# EAGLE board AT SoM Carrier Board V1.1 (EAGLE 9.6.1), part 1 of 2
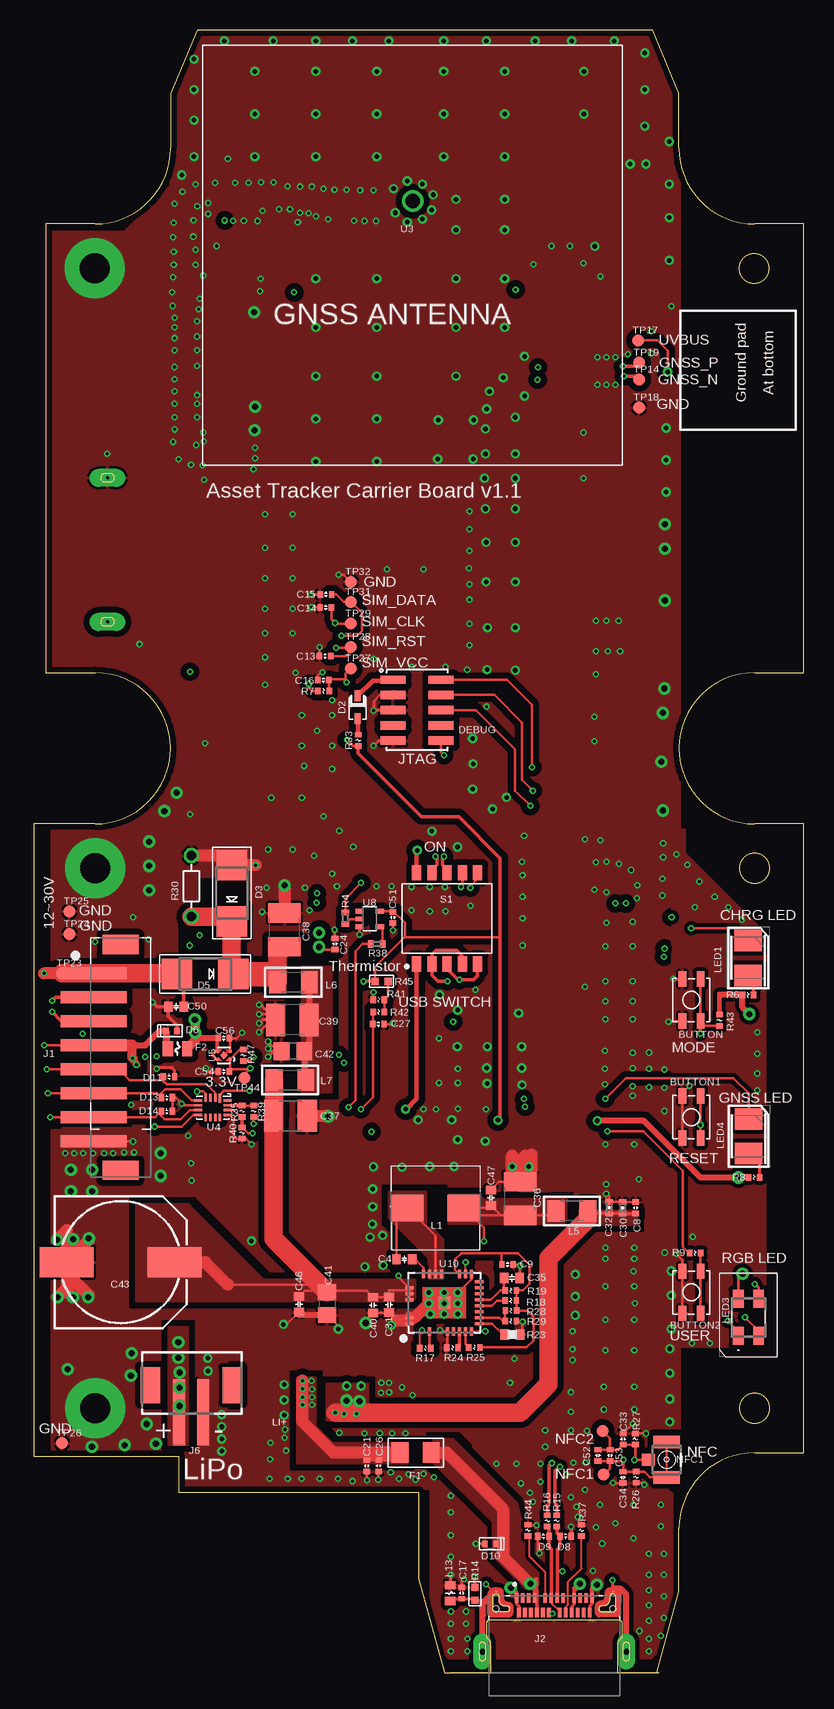
[diagram p4: board, top side]
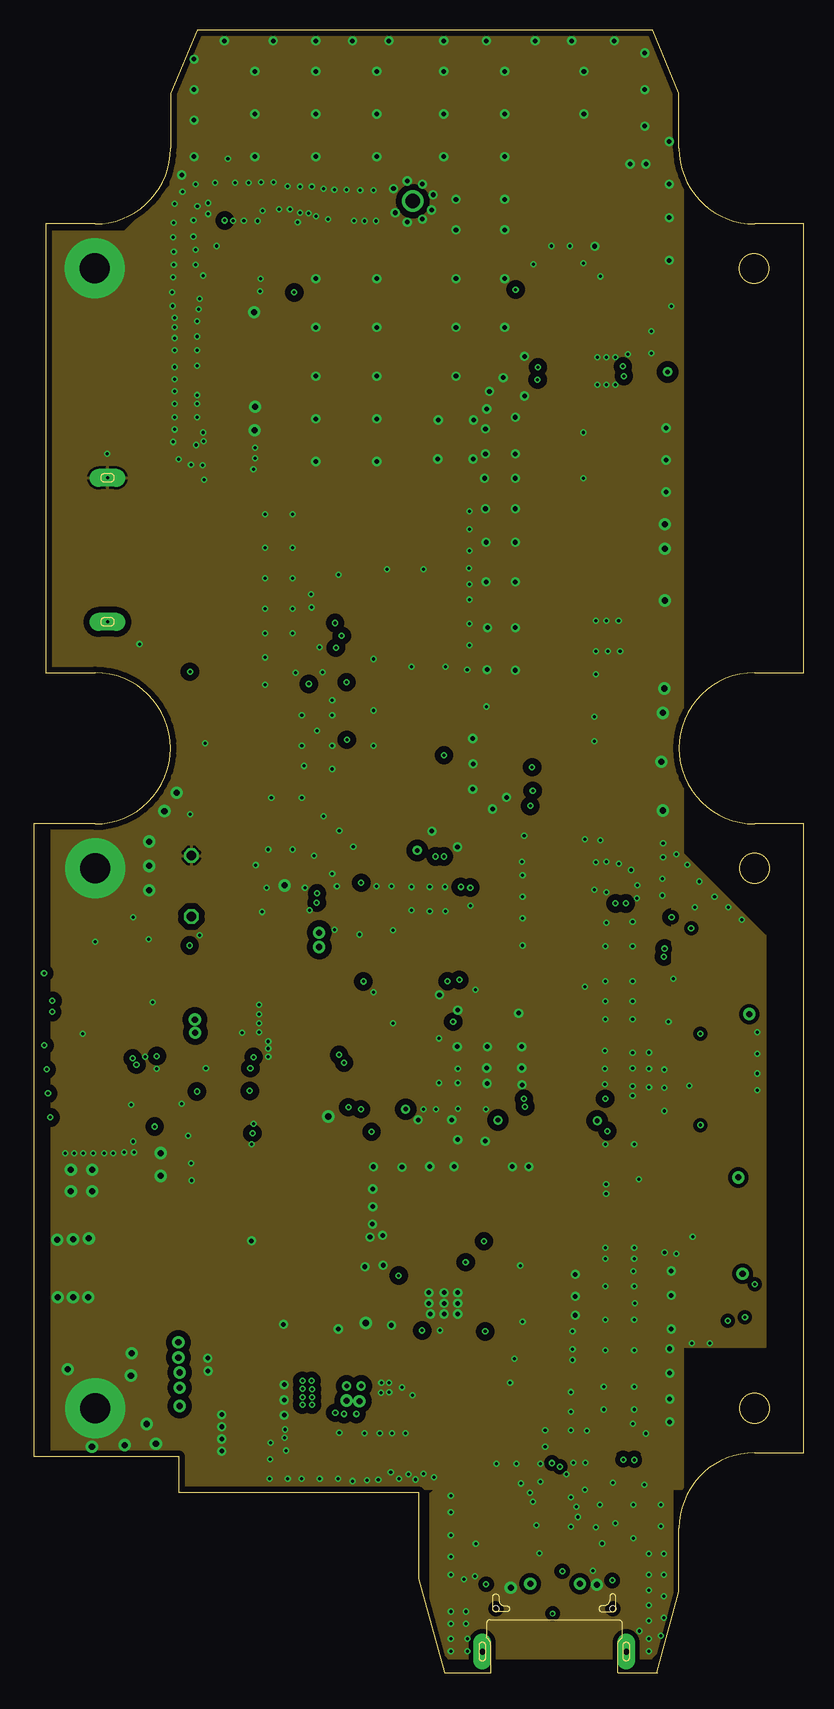
[diagram p5: board, inner layer L2-SIGNAL]
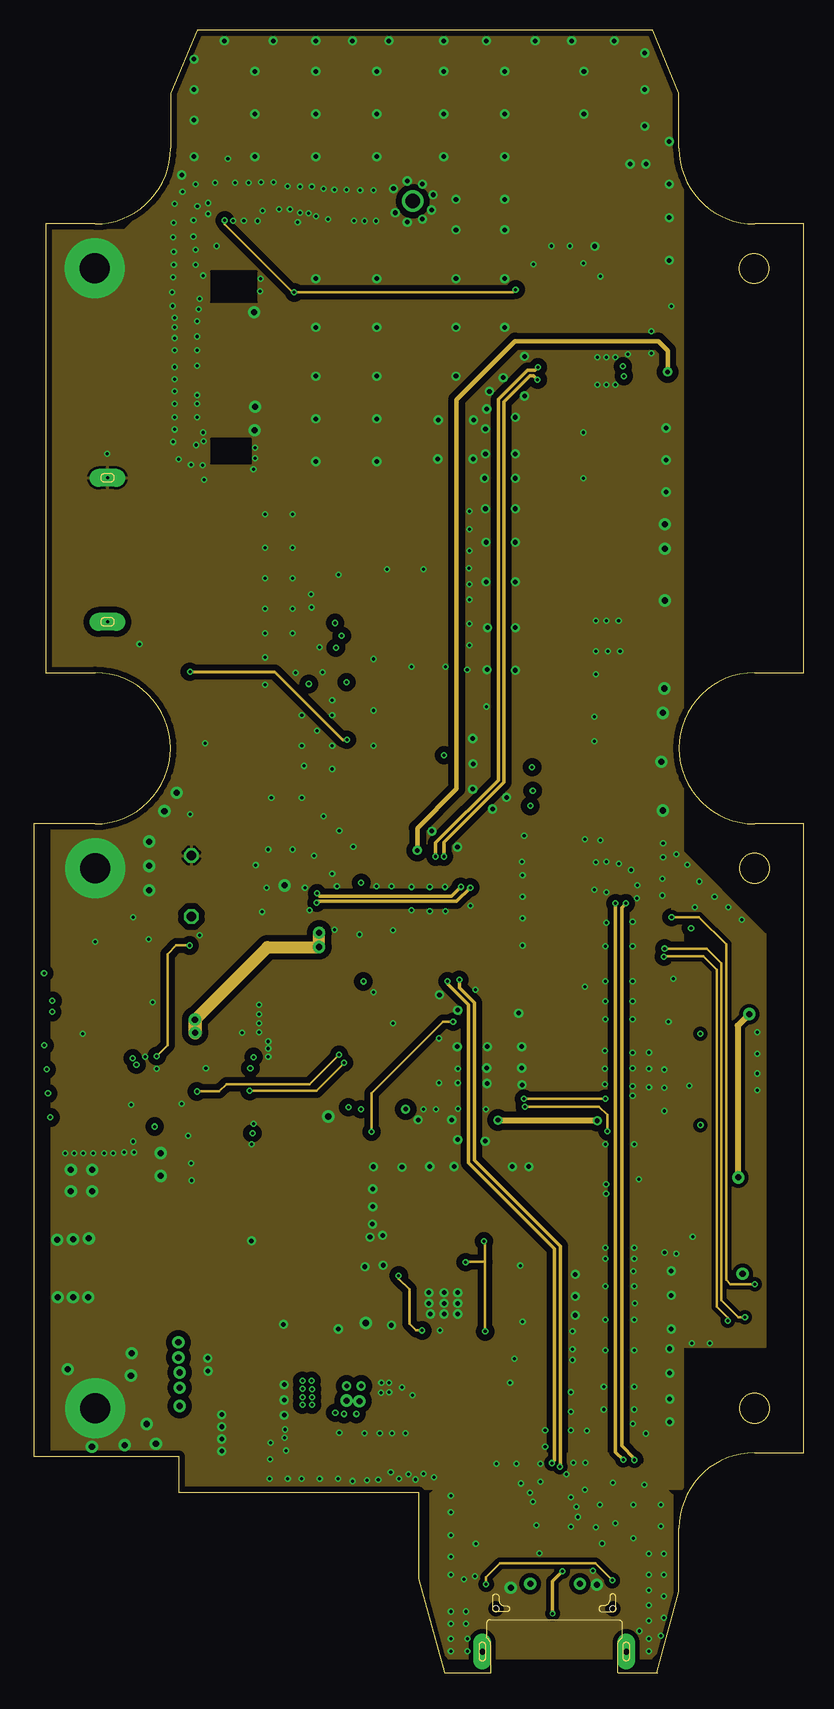
[diagram p6: board, inner layer L5-SIGNAL]
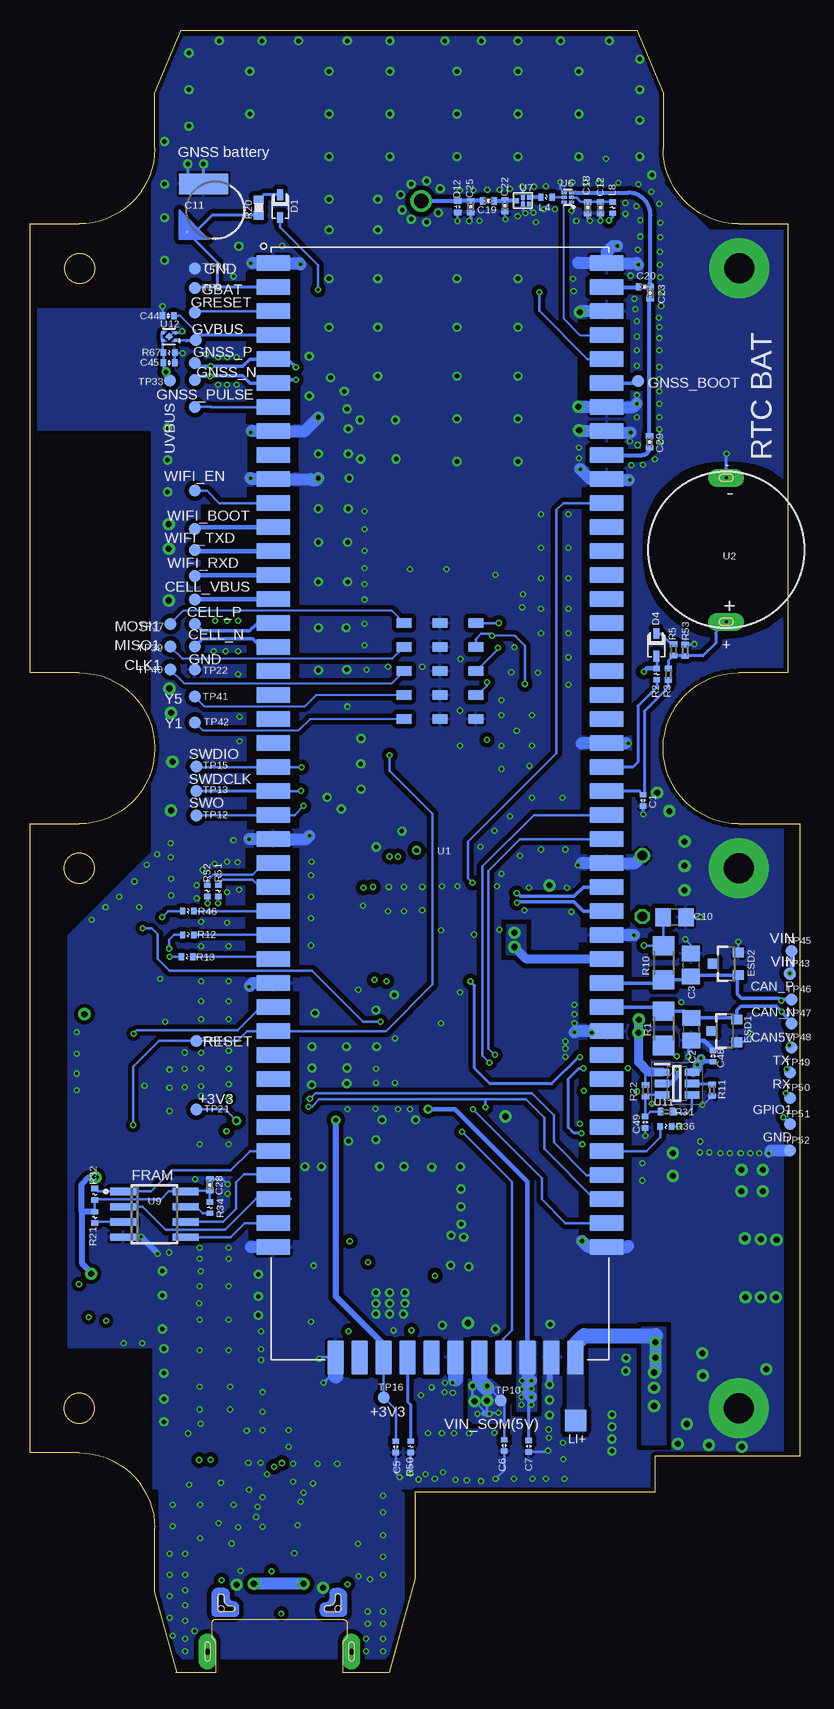
[diagram p7: board, bottom side, seen from below]

Size 64.2 x 136.88 mm. Coordinates in mm from the lower left corner, seen from the top.
Outline: 53.8,6.72 53.8,12.02 arc-90 60.1,18.32 64.2,18.32 64.2,70.72 60.1,70.72 arc-180 60.1,83.32 64.2,83.32 64.2,120.72 60.1,120.72 arc-90 53.8,127.02 53.8,131.6 51.6,136.88 13.6,136.88 11.4,131.6 11.4,127.02 arc-90 5.1,120.72 1,120.72 1,83.32 5.1,83.32 arc-180 5.1,70.72 0,70.72 0,18.02 12.09,18.02 12.09,15.02 32.09,15.02 32.09,7.81 34.26,0 38.1,0 38.09,0
Outline: 48.69,0 51.93,0 53.79,6.73
Outline: circle at 60.09,22.02 radius 1.25
Outline: circle at 60.1,22.02 radius 1.25
Outline: circle at 60.1,22.02 radius 1.25
Outline: circle at 60.09,67.02 radius 1.25
Outline: circle at 60.05,117 radius 1.25
Copper layers (1+2*15+16): L1-TOP 0.035mm / dielectric 0.1mm / L2-SIGNAL 0.0175mm / dielectric 0.365mm / L5-SIGNAL 0.035mm / dielectric 0.1mm / L6-BOTTOM 0.035mm
Design rules "particle-6layer *": minimum track width 4mil, minimum drill 0.1mm, track to track 6mil, track to pad 6mil, pad to pad 6mil, via to via 6mil, smd to smd 0mil, copper to edge 6mil, drill to drill 6mil, minimum pad ring 4mil, minimum via ring 4mil, stop-mask expansion 0mil, vias tented up to drill 20mil, thermal gap 8mil
Net classes: 2 RF: width 0.293 mm, clearance 0.257 mm; 3 usb_lay3: width 0.279 mm, clearance 0.203 mm; 4 3V3: width 0.305 mm, clearance 0.508 mm; 5 USB_top: width 0.279 mm, drill 0.254 mm, clearance 0.203 mm; 6 +3V3: width 0.203 mm, clearance 0.152 mm; 7 PMID: width 0.305 mm, clearance 0.508 mm; 8 CAN: width 0.152 mm, clearance 0.267 mm

## Footprints (pad centres in the part's own frame; a part is rotated, then mirrored left to right if it is on the bottom)
TS-1185A-020 = smd 1.27 x 0.635: 1 -1.75,0.752; 2 1.75,0.752; 3 -1.75,-0.752; 4 1.75,-0.752
C-0402 = smd 0.45 x 0.55: 1 -0.47,0; 2 0.47,0
C0805 = smd 1.3 x 1.5: 1 -0.95,0; 2 0.95,0
C-0603A = smd 0.7 x 0.85: 1 -0.65,0; 2 0.65,0
ML414H = smd 0.2 x 0.2: + 2.4,1.8 | smd 4.1 x 1.7: - 1,-2.2
C0402_P = smd 0.457 x 0.61: 1 -0.483,0; 2 0.483,0
PARTICLE-SZ_C-0402 = smd 0.45 x 0.55: 1 -0.47,0; 2 0.47,0
C1210 = smd 1.6 x 2.7: 1 -1.4,0; 2 1.4,0
NIC_10X10.5_CAP = smd 4.5 x 2.5: + 4.5,0; - -4.5,0
SOD-323 = smd 0.9 x 0.5: 1 -0.95,0; 2 0.95,0
SMADIODE = smd 2.54 x 2.54: A 2.349,0; C -2.349,0
0402-TVS-UNIDIR = smd 0.45 x 0.55: 1 -0.47,0; 2 0.47,0
C0402 = smd 0.45 x 0.6: 1 -0.47,0; 2 0.47,0
CON5X2_1.27 = smd 0.7 x 2.1: 1 -2.54,-2; 2 -2.54,2; 3 -1.27,-2; 4 -1.27,2; 5 0,-2; 6 0,2; 7 1.27,-2; 8 1.27,2; 9 2.54,-2; 10 2.54,2
SOT23-3 = smd 0.8 x 0.9: 1 -0.95,-1; 2 0.95,-1; 3 0,1.1
R1206 = smd 1.4 x 1.7: 1 -1.3,0; 2 1.3,0
F0805 = smd 0.85 x 1.25: P$1 -0.8,0; P$2 0.8,0
JST_B8B-PH-SM4-TB(LF)(SN) = smd 1 x 5.5: 1 -5,0; 2 -3,0; 3 -1,0; 4 1,0; 5 3,0; 6 5,0; 7 7,0; 8 9,0 | smd 1.6 x 3: P1 -7.4,2.25; P2 11.4,2.25
AMPHENOL_124018312112A = smd 0.3 x 0.8: A1 -3.15,4.45; A2 -2.65,4.45; A3 -2.15,4.45; A4 -1.65,4.45; A5 -0.75,4.45; A6 -0.25,4.45; A7 0.25,4.45; A8 0.75,4.45; A9 1.65,4.45; A10 2.15,4.45; A11 2.65,4.45; A12 3.15,4.45; B1 2.95,3.25; B2 2.45,3.25; B3 1.95,3.25; B4 1.45,3.25; B5 0.95,3.25; B6 0.45,3.25; B7 -0.45,3.25; B8 -0.95,3.25; B9 -1.45,3.25; B10 -1.95,3.25; B11 -2.45,3.25; B12 -2.95,3.25 | drill 0.5 pad 1.5 long: S1 -6,0; S2 6,0 | smd 0.1 x 0.1: S3 -4.849,5.002; S4 4.901,4.976 | hole 0.5: -4.875,3.56; 4.875,3.56
JST-2-SMD-VERT = smd 1 x 5.5: GND 1,-2; VCC -1,-2 | smd 1.6 x 3: P$1 -3.4,0.27; P$2 3.4,0.27
ETQP4M150KFN = smd 2.7 x 2.2: 1 -2.35,0; 2 2.35,0
R-0402S = smd 0.45 x 0.55: 1 -0.47,0; 2 0.47,0
L1206 = smd 1.4 x 1.8: 1 -1.329,0; 2 1.329,0
R-0603A = smd 0.7 x 0.85: 1 -0.65,0; 2 0.65,0
LEDM3528X210N = smd 1.8 x 2.3: 1 -1.45,0; 2 1.45,0
150141M173100 = smd 1.5 x 0.9: 1 1.55,0.85; 2 1.55,-0.85; 3 -1.55,0.85; 4 -1.55,-0.85
IPEX-20279-001E = smd 1 x 1.05: 1 0,1.528 | smd 1.05 x 2.2: 2@1 -1.475,0; 2@2 1.475,0
R1206' = smd 1.6 x 1.803: 1 -1.422,0; 2 1.422,0
R0402_B = smd 0.457 x 0.61: 1 -0.483,0; 2 0.483,0
REDBEAR_R0603 = smd 0.6 x 0.6: 1 -0.55,0; 2 0.55,0
R0603_P = smd 0.7 x 0.85: 1 -0.65,0; 2 0.65,0
R-5 = drill 0.813 octagon: 1 -2.54,0; 2 2.54,0
R0603 = smd 0.6 x 0.6: 1 -0.55,0; 2 0.55,0
416131160805 = smd 0.76 x 1.27: 1 -2.54,-3.81; 2 -1.27,-3.81; 3 0,-3.81; 4 1.27,-3.81; 5 2.54,-3.81; A1 -2.54,3.81; A2 -1.27,3.81; A3 0,3.81; A4 1.27,3.81; A5 2.54,3.81
TP10R = smd 1 x 1: TP 0,0
TRACKERSOM_V04 = smd 2.8 x 1.35: 1 27.9,-91.3; 2 27.9,-89.3; 3 27.9,-87.3; 4 27.9,-85.3; 5 27.9,-83.3; 6 27.9,-81.3; 7 27.9,-79.3; 8 27.9,-77.3; 9 27.9,-75.3; 10 27.9,-73.3; 11 27.9,-71.3; 12 27.9,-69.3; 13 27.9,-67.3; 14 27.9,-65.3; 15 27.9,-63.3; 16 27.9,-61.3; 17 27.9,-59.3; 18 27.9,-57.3; 19 27.9,-55.3; 20 27.9,-53.3; 21 27.9,-51.3; 22 27.9,-49.3; 23 27.9,-47.3; 24 27.9,-45.3; 25 27.9,-43.3; 26 27.9,-41.3; 27 27.9,-39.3; 28 27.9,-37.3; 29 27.9,-35.3; 30 27.9,-33.3; 31 27.9,-31.3; 32 27.9,-29.3; 33 27.9,-27.3; 34 27.9,-25.3; 35 27.9,-23.3; 36 27.9,-21.3; 37 27.9,-19.3; 38 27.9,-17.3; 39 27.9,-15.3; 40 27.9,-13.3; 41 27.9,-11.3; 42 27.9,-9.3; 54 0.1,-9.3; 55 0.1,-11.3; 56 0.1,-13.3; 57 0.1,-15.3; 58 0.1,-17.3; 59 0.1,-19.3; 60 0.1,-21.3; 61 0.1,-23.3; 62 0.1,-25.3; 63 0.1,-27.3; 64 0.1,-29.3; 65 0.1,-31.3; 66 0.1,-33.3; 67 0.1,-35.3; 68 0.1,-37.3; 69 0.1,-39.3; 70 0.1,-41.3; 71 0.1,-43.3; 72 0.1,-45.3; 73 0.1,-47.3; 74 0.1,-49.3; 75 0.1,-51.3; 76 0.1,-53.3; 77 0.1,-55.3; 78 0.1,-57.3; 79 0.1,-59.3; 80 0.1,-61.3; 81 0.1,-63.3; 82 0.1,-65.3; 83 0.1,-67.3; 84 0.1,-69.3; 85 0.1,-71.3; 86 0.1,-73.3; 87 0.1,-75.3; 88 0.1,-77.3; 89 0.1,-79.3; 90 0.1,-81.3; 91 0.1,-83.3; 92 0.1,-85.3; 93 0.1,-87.3; 94 0.1,-89.3; 95 0.1,-91.3 | smd 1.35 x 2.8: 43 22.7,-0.1; 44 20.7,-0.1; 45 18.7,-0.1; 46 16.7,-0.1; 47 14.7,-0.1; 48 12.7,-0.1; 49 10.7,-0.1; 50 8.7,-0.1; 51 6.7,-0.1; 52 4.7,-0.1; 53 2.7,-0.1 | smd 1.3 x 0.83: 96 17,-61.3; 97 17,-59.3; 98 17,-57.3; 99 17,-55.3; 100 17,-53.3; 101 11,-55.3; 102 11,-57.3; 103 11,-59.3; 104 11,-61.3; 105 11,-53.3; 106 14,-53.3; 107 14,-55.3; 108 14,-57.3; 109 14,-59.3; 110 14,-61.3
BAT_ML-1220/DIP = drill 0.254 pad 1.5 long: 1 0,12; 2 0,0
PA035AZ0004 = drill 1.2 pad 1.8: P$1 0,-4.5
UQFN-16 = smd 0.2 x 0.75: 1 -0.6,-0.775 | smd 0.2 x 0.65: 2 -0.2,-0.825; 3 0.2,-0.825; 4 0.6,-0.825; 9 0.6,0.825; 10 0.2,0.825; 11 -0.2,0.825; 12 -0.6,0.825 | smd 0.65 x 0.2: 5 1.225,-0.6; 6 1.225,-0.2; 7 1.225,0.2; 8 1.225,0.6; 13 -1.225,0.6; 14 -1.225,0.2; 15 -1.225,-0.2; 16 -1.225,-0.6
USPQ-4B04 = smd 0.25 x 0.22: P$1 -0.325,-0.54; P$2 0.325,-0.54; P$3 0.325,0.54; P$4 -0.325,0.54 | smd 0.45 x 0.45 rotated 45: P$5 0,0
LNA-TSLP-6-2-ALT = smd 0.45 x 0.25: 1 -0.3,0.4; 2 -0.3,0; 3 -0.3,-0.4; 4 0.3,-0.4; 5 0.3,0; 6 0.3,0.4
QCS5I = smd 0.35 x 0.425: 1 -0.5,0; 2 0,-0.287; 3 0.5,-0.287; 4 0.5,0.287; 5 0,0.287
SC70-5 = smd 0.4 x 0.7: 1 -0.65,-0.85; 2 0,-0.85; 3 0.65,-0.85; 4 0.65,0.85; 5 -0.65,0.85
SO08 = smd 0.6 x 2.2: 1 -1.905,-2.6; 2 -0.635,-2.6; 3 0.635,-2.6; 4 1.905,-2.6; 5 1.905,2.6; 6 0.635,2.6; 7 -0.635,2.6; 8 -1.905,2.6
UHE36(26)QFN = smd 0.25 x 0.7: 3 -1.25,-2.4; 6 0.25,-2.4; 7 0.75,-2.4; 8 1.25,-2.4; 9 1.75,-2.4; 10 2.25,-2.4; 19 2.25,2.4; 20 1.75,2.4; 21 1.25,2.4; 24 -0.25,2.4; 25 -0.75,2.4; 26 -1.25,2.4; 27 -1.75,2.4 | smd 0.7 x 0.25: 11 2.9,-1.75; 12 2.9,-1.25; 13 2.9,-0.75; 14 2.9,-0.25; 15 2.9,0.25; 16 2.9,0.75; 17 2.9,1.25; 18 2.9,1.75; 30 -2.9,1.25; 31 -2.9,0.75; 32 -2.9,0.25; 35 -2.9,-1.25; 36 -2.9,-1.75 | smd 1 x 1: 37 0,0
SOT95P280X145-6N = smd 1.2 x 0.6: 1 -1.25,0.95; 2 -1.25,0; 3 -1.25,-0.95; 4 1.25,-0.95; 5 1.25,0; 6 1.25,0.95
TP70_BOT = smd 1.778 x 1.778 bottom: P$1 0,0

## Placement (x,y rotation side)
BUTTON  TS-1185A-020  [TS-1185A-020]  54.83,56.04 90 top
BUTTON1  TS-1185A-020  [TS-1185A-020]  54.83,46.29 90 top
BUTTON2  TS-1185A-020  [TS-1185A-020]  54.83,31.68 90 top
C1  0.1uF  [C-0402]  13.08,72.68 270 bottom
C2  47pF,200V  [C0805]  9.07,53.61 270 bottom
C3  47pF,200V  [C0805]  9.1,58.96 270 bottom
C4  0.1uF/100V  [C-0603A]  30.89,34.44 0 top
C5  0.1uF  [C-0402]  33.7,18.8 270 bottom
C6  0.1uF  [C-0402]  24.66,18.93 270 bottom
C7  0.1uF  [C-0402]  22.6,18.85 270 bottom
C8  1uF/16V  [C-0402]  50.18,38.73 90 top
C9  1uF/16V  [C-0402]  39.51,34 0 top
C10  DNP/4700pF,100V  [C0805]  10.46,62.94 180 bottom
C11  ML414H-IV01E  [ML414H]  48.73,121.86 180 bottom
C12  1uF  [C0402_P]  16.63,122.07 270 bottom
C13  33pF  [C-0402]  24.28,84.7 0 top
C14  33pF  [C-0402]  24.34,88.76 0 top
C15  33pF  [C-0402]  24.35,89.85 0 top
C16  100nF  [C-0402]  24.14,82.7 180 top
C17  0.1uF 16V  [PARTICLE-SZ_C-0402]  35.68,6.62 90 top
C18  0.1uF  [C0402_P]  17.7,122.08 270 bottom
C19  47pF  [C0402_P]  25.97,122.64 180 bottom
C20  100pF  [C0402_P]  12.95,115.48 0 bottom
C21  0.1uF 16V  [C-0402]  27.76,17.22 270 top
C22  NC 47pF  [C0402_P]  24.6,122.23 270 bottom
C23  NC 100pF  [C0402_P]  12.49,114.97 270 bottom
C24  0.1uF  [C-0402]  25.11,60.71 90 top
C25  NC 47pF  [C0402_P]  27.45,122.16 90 bottom
C26  1uF  [C-0402]  28.75,17.23 90 top
C27  1uF  [C-0402]  28.73,54.03 0 top
C28  NC 0.1uF  [C0402_P]  49.2,40.63 90 bottom
C29  NC 100pF  [C0402_P]  12.54,102.55 270 bottom
C30  100pF  [C0402_P]  49.09,38.72 90 top
C31  0.1uF/100V  [C-0603A]  29.63,30.64 270 top
C32  0.1uF  [C0402_P]  47.97,38.74 90 top
C33  82pF  [C-0402]  49.13,19.46 270 top
C34  82pF  [C-0402]  49.12,16.26 90 top
C35  0.1uF/100V  [C-0603A]  39.87,32.88 0 top
C36  100uF,10V  [C1210]  40.54,39.49 90 top
C37  4.7uF,100V  [C1210]  21.4,46.4 0 top
C38  4.7uF,100V  [C1210]  20.9,61.89 90 top
C39  4.7uF,100V  [C1210]  21.55,54.39 180 top
C40  0.1uF/100V  [C-0603A]  28.27,30.63 270 top
C41  1uF,100V  [C0805]  24.45,30.74 270 top
C42  0.22uF,100V  [C0805]  21.61,51.78 180 top
C43  33uF,100V  [NIC_10X10.5_CAP]  7.25,34.2 0 top
C44  0.1uF  [C-0402]  52.67,113.06 0 bottom
C45  0.1uF  [C-0402]  52.6,109.15 180 bottom
C46  1nF/100V  [C-0603A]  22.12,30.69 270 top
C47  1nF/100V  [C-0603A]  38.12,39.56 90 top
C48  0.1uF  [C-0402]  7.23,51.37 90 bottom
C49  0.1uF  [C-0402]  12.9,45.85 270 bottom
C50  100pF/100V  [C-0603A]  11.86,55.48 180 top
C51  NC 0.1uF  [C-0402]  29.94,62.92 270 top
C52  NC  [C-0402]  47.03,18.09 270 top
C53  NC  [C-0402]  48.05,18.09 270 top
C54  0.1uF  [C-0402]  15.84,50.07 180 top
C56  0.1uF  [C-0402]  15.84,52.87 0 top
D1  1N5711WS-7-F  [SOD-323]  43.33,122.21 90 bottom
D2  B5817WS  [SOD-323]  27,80.45 90 top
D3  SMAJ60A  [SMADIODE]  16.51,64.95 90 top
D4  DNP/1N5711WS-7-F  [SOD-323]  11.98,85.63 90 bottom
D5  B230A-13-F 30V2A  [SMADIODE]  14.29,58.21 180 top
D6  ESD7951ST5G  [0402-TVS-UNIDIR]  11.47,53.47 0 top
D8  RCLAMP0521P-N  [C0402]  44.34,11.36 180 top
D9  RCLAMP0521P-N  [C0402]  42.49,11.36 0 top
D10  ESD7951ST5G  [0402-TVS-UNIDIR]  38.07,10.73 180 top
D11  RCLAMP0521P-N  [C0402]  11.27,49.64 0 top
D12  RCLAMP0521P-N  [C0402]  28.54,122.15 270 bottom
D13  RCLAMP0521P-N  [C0402]  11.09,47.91 0 top
D14  RCLAMP0521P-N  [C0402]  11.09,46.77 0 top
DEBUG  CON5X2  [CON5X2_1.27]  31.95,80.2 270 top
ESD1  MMBZ27VCLT1  [SOT23-3]  6.27,53.48 90 bottom
ESD2  MMBZ27VCLT1  [SOT23-3]  6.15,59.06 90 bottom
F1  RF1512-000  [R1206]  31.85,18.32 180 top
F2  DNP/SMD0805P020TF  [F0805]  11.98,52 0 top
J1  B8B-PH-SM4-TB(LF)(SN)  [JST_B8B-PH-SM4-TB(LF)(SN)]  4.99,53.26 270 top
J2  124018312112A  [AMPHENOL_124018312112A]  43.4,1.75 0 top
J6  [JST-2-SMD-VERT]  13.13,23.68 0 top
L1  ETQ-P4M150KFN  [ETQP4M150KFN]  33.51,38.72 0 top
L4  LQW15AN7N5G00D  [R-0402S]  21.13,122.94 180 bottom
L5  BLM31PG121SN1  [L1206]  44.87,38.45 0 top
L6  BLM31PG121SN1  [L1206]  21.64,57.52 0 top
L7  BLM31PG121SN1  [L1206]  21.36,49.38 180 top
L8  47nH  [R-0402S]  15.62,122.08 90 bottom
L13  NC  [R-0603A]  34.72,6.62 90 top
LED1  67-21/Y2C-AP2R1BZ/2T  [LEDM3528X210N]  59.57,59.55 270 top
LED3  LTST-T680UGWT  [150141M173100]  59.58,29.6 90 top
LED4  67-21SUBC/S400-A4/TR8  [LEDM3528X210N]  59.6,44.69 270 top
NFC1  UFL  [IPEX-20279-001E]  52.77,17.74 90 top
R1  DNP/60.4R,1%  [R1206']  11.38,53.68 90 bottom
R2  NC  [R-0402S]  11.94,83.21 90 bottom
R3  0R  [R0402_B]  10.97,83.19 90 bottom
R4  NC 0R  [R0402_B]  25.98,62.87 90 top
R5  DNP/200R  [R0402_B]  10.54,85.22 90 bottom
R6  330R  [R-0402S]  59.55,56.46 0 top
R7  15K  [R-0402S]  24.16,81.78 0 top
R8  330R  [R-0402S]  60.06,41.27 0 top
R9  100R  [R-0402S]  55.14,34.96 0 top
R10  DNP/60.4R,1%  [R1206']  11.36,59.15 90 bottom
R11  137K  [R0402_B]  7.33,48.52 90 bottom
R12  330R  [R-0402S]  51,61.48 180 bottom
R13  330R  [R-0402S]  51.1,59.65 180 bottom
R14  1M  [REDBEAR_R0603]  36.78,6.57 90 top
R15  0R  [R-0402S]  43.61,12.64 90 top
R16  0R  [R-0402S]  42.82,12.64 90 top
R17  10M  [R-0402S]  32.64,27.03 180 top
R18  10K  [R-0402S]  39.77,30.99 180 top
R19  75K/DNP  [R-0402S]  39.77,31.84 0 top
R20  3.3K  [R0603_P]  45.13,122.08 90 bottom
R21  NC 100K  [R-0402S]  58.81,37.92 90 bottom
R22  100K  [R0402_B]  12.87,48.5 90 bottom
R23  17.8K  [R0603_P]  39.9,28.18 180 top
R24  8.87K  [R-0402S]  34.9,27.06 0 top
R25  0R  [R-0402S]  36.73,27.1 180 top
R26  82pF  [R-0402S]  50.21,16.28 270 top
R27  82pF  [R-0402S]  50.16,19.46 270 top
R28  100K  [R-0402S]  39.79,30.16 180 top
R29  DNP  [R-0402S]  39.77,29.29 180 top
R30  DNP  [R-5]  13.14,65.54 90 top
R31  DNP/0R  [R0402_B]  11.12,46.74 180 bottom
R32  NC 10K  [R-0402S]  58.81,39.86 270 bottom
R33  1k  [R-0402S]  27.05,77.68 270 top
R34  NC 100K  [R-0402S]  49.21,38.74 90 bottom
R35  100K  [R-0402S]  17.37,46.77 90 top
R36  0R  [R-0402S]  11.19,45.52 0 bottom
R37  5.1k  [R-0402S]  45.66,11.84 270 top
R38  NC  [R0402_B]  28.59,60.71 0 top
R39  DNP/100K  [R-0402S]  18.33,46.77 90 top
R40  1M  [R-0402S]  17.37,44.97 90 top
R41  100k  [R-0402S]  28.76,56.07 180 top
R42  4.7k  [R-0402S]  28.76,55.05 180 top
R43  4.7k  [R-0402S]  57.18,54.35 270 top
R44  5.1k  [R-0402S]  41.2,11.84 270 top
R45  ERTJ1VR104FM  [R0603]  29,57.59 0 top
R46  330R  [R-0402S]  51,63.46 180 bottom
R47  DNP/0R  [R-0402S]  17.47,51.44 90 top
R50  NC 10K  [R-0402S]  32.46,18.8 270 bottom
R51  0R  [R-0402S]  48.51,65.13 90 bottom
R52  0R  [R-0402S]  49.4,65.13 90 bottom
R53  0R  [R0402_B]  9.57,85.21 270 bottom
R67  1M  [R-0402S]  52.6,109.99 180 bottom
S1  416131160805  [416131160805]  34.46,62.85 0 top
TP1  TPTP10R  [TP10R]  50.46,91.37 0 bottom
TP2  TPTP10R  [TP10R]  50.46,93.53 0 bottom
TP3  TPTP10R  [TP10R]  50.46,95.31 0 bottom
TP4  TPTP10R  [TP10R]  50.46,98.48 0 bottom
TP5  TPTP10R  [TP10R]  50.46,109.14 0 bottom
TP6  TPTP10R  [TP10R]  13.51,107.63 0 bottom
TP7  TPTP10R  [TP10R]  50.46,105.47 0 bottom
TP8  TPTP10R  [TP10R]  50.46,113.34 0 bottom
TP9  TPTP10R  [TP10R]  50.46,115.37 0 bottom
TP10  TPTP10R  [TP10R]  24.94,22.66 0 bottom
TP11  TPTP10R  [TP10R]  50.34,52.64 0 bottom
TP12  TPTP10R  [TP10R]  50.34,71.43 0 bottom
TP13  TPTP10R  [TP10R]  50.34,73.46 0 bottom
TP14  TPTP10R  [TP10R]  50.46,107.75 0 top
TP15  TPTP10R  [TP10R]  50.34,75.5 0 bottom
TP16  TPTP10R  [TP10R]  34.72,22.92 0 bottom
TP17  TPTP10R  [TP10R]  50.39,111.01 0 top
TP18  TPTP10R  [TP10R]  50.46,105.42 0 top
TP19  TPTP10R  [TP10R]  50.46,109.15 0 top
TP20  TPTP10R  [TP10R]  50.46,117 0 bottom
TP21  TPTP10R  [TP10R]  50.34,46.92 0 bottom
TP22  TPTP10R  [TP10R]  50.46,83.57 0 bottom
TP23  TPTP10R  [TP10R]  2.36,58.27 0 top
TP24  TPTP10R  [TP10R]  2.97,61.53 0 top
TP25  TPTP10R  [TP10R]  2.97,63.43 0 top
TP26  TPTP10R  [TP10R]  2.33,19.11 0 top
TP27  TPTP10R  [TP10R]  26.44,83.68 0 top
TP28  TPTP10R  [TP10R]  26.44,85.48 0 top
TP29  TPTP10R  [TP10R]  26.44,87.41 0 top
TP30  TPTP10R  [TP10R]  50.36,111.03 0 bottom
TP31  TPTP10R  [TP10R]  26.44,89.21 0 top
TP32  TPTP10R  [TP10R]  26.44,90.89 0 top
TP33  TPTP10R  [TP10R]  52.52,107.68 0 bottom
TP34  TPTP10R  [TP10R]  50.46,107.7 0 bottom
TP35  TPTP10R  [TP10R]  50.46,89.43 0 bottom
TP36  TPTP10R  [TP10R]  50.46,87.4 0 bottom
TP37  TPTP10R  [TP10R]  52.5,87.4 0 bottom
TP38  TPTP10R  [TP10R]  50.46,85.49 0 bottom
TP39  TPTP10R  [TP10R]  52.5,85.49 0 bottom
TP40  TPTP10R  [TP10R]  52.5,83.57 0 bottom
TP41  TPTP10R  [TP10R]  50.46,81.34 0 bottom
TP42  TPTP10R  [TP10R]  50.46,79.18 0 bottom
TP43  TPTP10R  [TP10R]  0.81,58.22 0 bottom
TP44  TPTP10R  [TP10R]  17.55,49.54 0 top
TP45  TPTP10R  [TP10R]  0.68,60.13 0 bottom
TP46  TPTP10R  [TP10R]  0.71,56.1 0 bottom
TP47  TPTP10R  [TP10R]  0.71,54.1 0 bottom
TP48  TPTP10R  [TP10R]  0.71,52.1 0 bottom
TP49  TPTP10R  [TP10R]  0.81,50 0 bottom
TP50  TPTP10R  [TP10R]  0.81,47.9 0 bottom
TP51  TPTP10R  [TP10R]  0.81,45.7 0 bottom
TP52  TPTP10R  [TP10R]  0.81,43.5 0 bottom
U1  TRACKERSOM_V04  [TRACKERSOM_V04]  16.01,26.16 180 bottom
U2  MIL-1220/DIP  [BAT_ML-1220/DIP]  6.14,87.56 0 bottom
U3  GNSS-ANTENNA  [PA035AZ0004]  31.59,118.11 180 top
U4  TS3A5018RSVR  [UQFN-16]  14.93,47.07 180 top
U5  XC6504USPQ  [USPQ-4B04]  15.84,51.44 90 top
U6  BGA725L6-ALT  [LNA-TSLP-6-2-ALT]  19.35,122.92 180 bottom
U7  B39162B4327P810  [QCS5I]  23.1,122.65 0 bottom
U8  NC SN74LV1T34  [SC70-5]  28.01,62.8 270 top
U9  NC MB85RS256BPNF-G-JNERE1  [SO08]  53.82,38.18 270 bottom
U10  LTC7103  [UHE36(26)QFN]  34.23,30.82 0 top
U11  TPS25221DBVR  [SOT95P280X145-6N]  10.26,49.08 0 bottom
U12  XC6504A3319R  [USPQ-4B04]  52.6,111.34 90 bottom
U$1  TP2  [TP70_BOT]  18.71,21.01 0 top
U$9  TPTP10R  [TP10R]  47.43,20.14 0 top
U$10  TPTP10R  [TP10R]  47.53,16.48 0 top